# Altium schematic sheet usb_ethernet.SchDoc: DevelBoard EVA01 USB Host and Ethernet Connectors.
size A3; Author: Daniele Basile <asterix@develer.com>; Organization: Develer s.r.l.; Address1: via Mugellese 1/A; Address2: 50019 Campi Bisenzio; Address3: Firenze; Address4: ITALY; DocumentNumber: 5; Revision: B; SheetNumber: 5; SheetTotal: 6; Hw_rev: R2
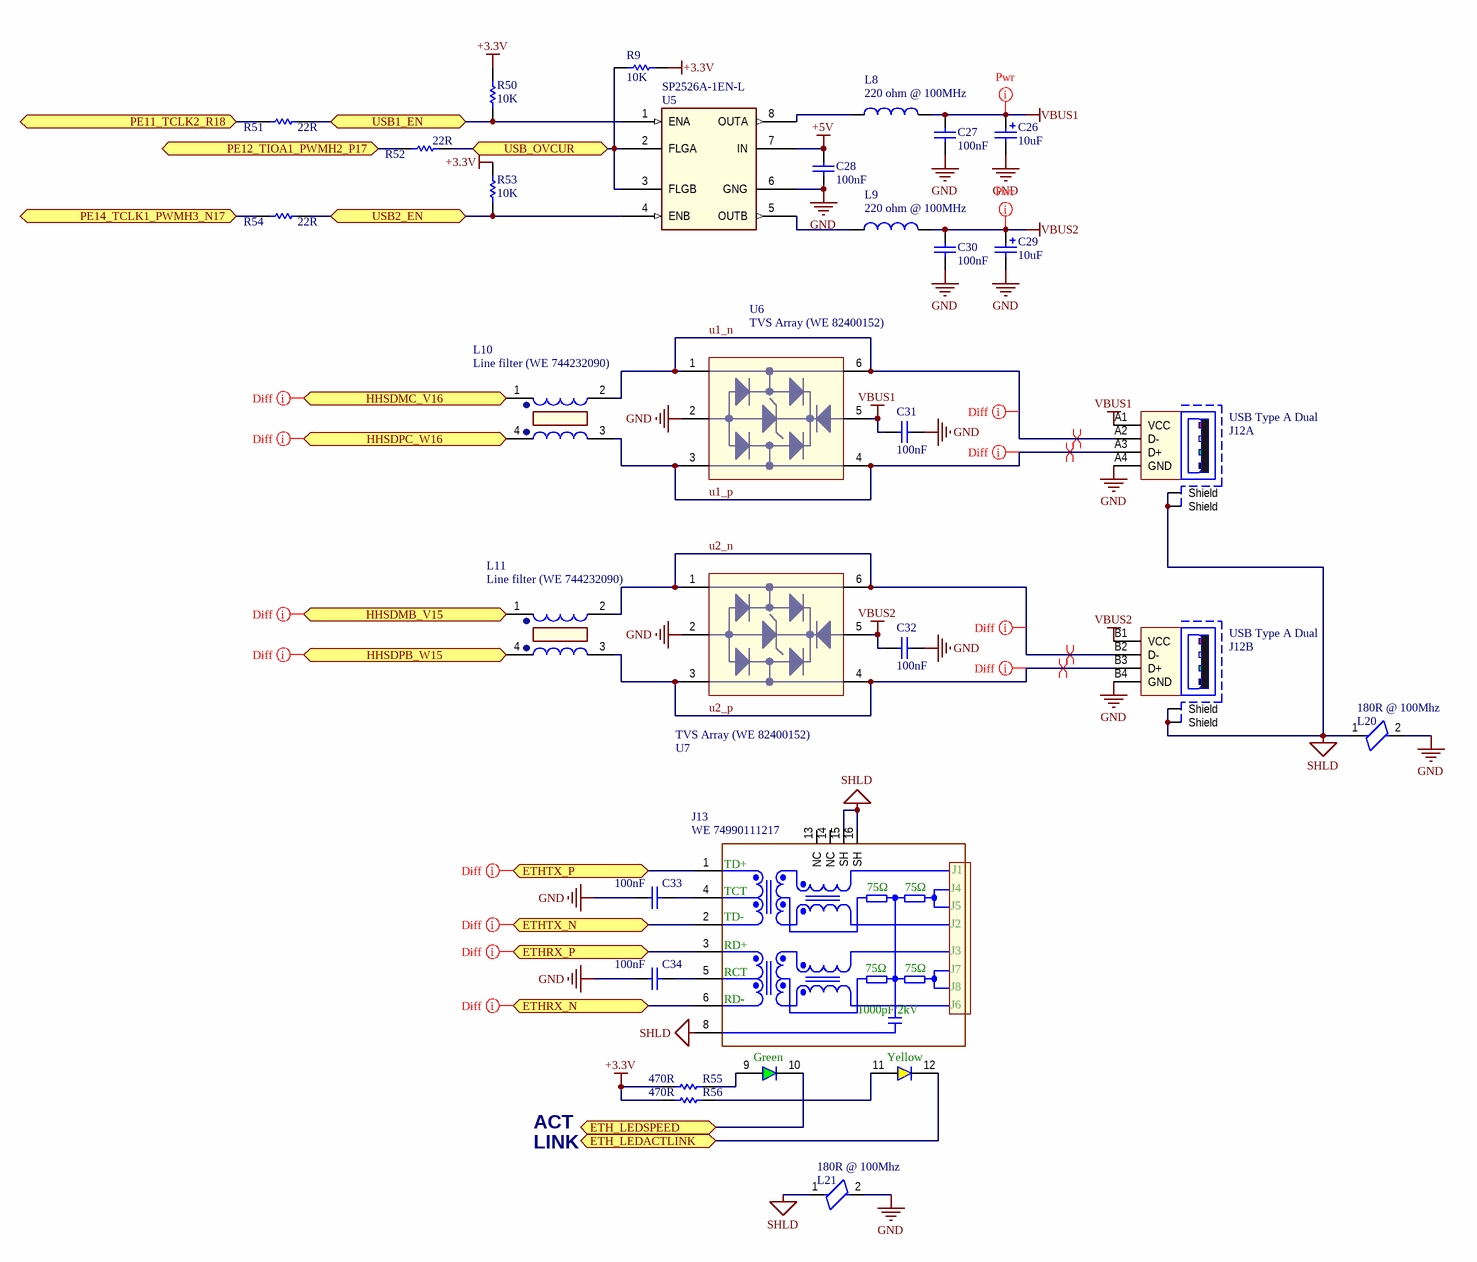
[diagram p0: usb_ethernet.SchDoc]

## Parts
C26  10uF  [1206_[3216]]
C27  100nF  [0603_[1608]]
C28  100nF  [0603_[1608]]
C29  10uF  [1206_[3216]]
C30  100nF  [0603_[1608]]
C31  100nF  [0603_[1608]]
C32  100nF  [0603_[1608]]
C33  100nF  [0603_[1608]]
C34  100nF  [0603_[1608]]
J12  USB Type A Dual  [USB_TypeA_Double_THD]  (parts A,B of 2)
J13  WE 74990111217  [RJ45_lan_transformer_horizontal]
L8  220 ohm @ 100MHz  [0805_[2012]]
L9  220 ohm @ 100MHz  [0805_[2012]]
L10  Line filter (WE 744232090)  [WE-CNSW_1206]
L11  Line filter (WE 744232090)  [WE-CNSW_1206]
L20  180R @ 100Mhz  [0603_[1608]]
L21  180R @ 100Mhz  [0603_[1608]]
R9  10K  [0603_[1608]]
R50  10K  [0603_[1608]]
R51  22R  [0603_[1608]]
R52  22R  [0603_[1608]]
R53  10K  [0603_[1608]]
R54  22R  [0603_[1608]]
R55  470R  [0603_[1608]]
R56  470R  [0603_[1608]]
U5  SP2526A-1EN-L  [SOIC8]
U6  TVS Array (WE 82400152)  [SOT-563]
U7  TVS Array (WE 82400152)  [SOT-563]

## Ports
ETH_LEDACTLINK, ETH_LEDSPEED, ETHRX_N, ETHRX_P, ETHTX_N, ETHTX_P, HHSDMB_V15, HHSDMC_V16, HHSDPB_W15, HHSDPC_W16, PE11_TCLK2_R18, PE12_TIOA1_PWMH2_P17, PE14_TCLK1_PWMH3_N17, USB1_EN, USB2_EN, USB_OVCUR

## Nets
+3.3V: R9.1 R50.1 R53.1 R55.2 R56.2
+5V: C28.1 U5.7(IN)
GND: C26.2 C27.2 C28.2 C29.2 C30.2 C31.1 C32.1 C33.2 C34.2 J12.A4(GND) J12.B4(GND) L20.2 L21.2 U5.6(GNG) U6.2 U7.2
SHLD: J12.Z1(Shield) J12.Z2(Shield) J12.Z3(Shield) J12.Z4(Shield) J13.8(SHLD) J13.15(SH) J13.16(SH) L20.1 L21.1
VBUS1: C26.1 C27.1 C31.2 J12.A1(VCC) L8.1 U6.5
VBUS2: C29.1 C30.1 C32.2 J12.B1(VCC) L9.1 U7.5
ETH_LEDACTLINK: J13.12(Kg) ; port ETH_LEDACTLINK
ETH_LEDSPEED: J13.10(Ky) ; port ETH_LEDSPEED
ETHRX_N: J13.6(RD-) ; port ETHRX_N
ETHRX_P: J13.3(RD+) ; port ETHRX_P
ETHTX_N: J13.2(TD-) ; port ETHTX_N
ETHTX_P: J13.1(TD+) ; port ETHTX_P
HHSDMB_V15: L11.1 ; port HHSDMB_V15
HHSDMC_V16: L10.1 ; port HHSDMC_V16
HHSDPB_W15: L11.4 ; port HHSDPB_W15
HHSDPC_W16: L10.4 ; port HHSDPC_W16
PE11_TCLK2_R18: R51.1 ; port PE11_TCLK2_R18
PE12_TIOA1_PWMH2_P17: R52.1 ; port PE12_TIOA1_PWMH2_P17
PE14_TCLK1_PWMH3_N17: R54.1 ; port PE14_TCLK1_PWMH3_N17
u1_n: J12.A2(D-) L10.2 U6.1 U6.6
u1_p: J12.A3(D+) L10.3 U6.3 U6.4
u2_n: J12.B2(D-) L11.2 U7.1 U7.6
u2_p: J12.B3(D+) L11.3 U7.3 U7.4
USB1_EN: R50.2 R51.2 U5.1(ENA) ; port USB1_EN
USB2_EN: R53.2 R54.2 U5.4(ENB) ; port USB2_EN
USB_OVCUR: R9.2 R52.2 U5.2(FLGA) U5.3(FLGB) ; port USB_OVCUR
NetC33_1: C33.1 J13.4(TCT)
NetC34_1: C34.1 J13.5(RCT)
NetJ13_9: J13.9(Ay) R55.1
NetJ13_11: J13.11(Ag) R56.1
NetL8_2: L8.2 U5.8(OUTA)
NetL9_2: L9.2 U5.5(OUTB)

Not connected (* = marked no-connect by the designer): J13 13(NC) 14(NC)

## Layout directives
net class Power: VBUS1, VBUS2
differential pair: u1_n, u1_p, u2_n, u2_p
net class usb1_diff: HHSDMC_V16, HHSDPC_W16, u1_n, u1_p
net class usb2_diff: HHSDMB_V15, HHSDPB_W15, u2_n, u2_p
net class eth_diff: ETHRX_N, ETHRX_P, ETHTX_N, ETHTX_P

## Notes on the sheet
- ACT
- LINK
- Title:
- Author:
- License:
- BSD
- Hw Rev:
- Rev:
- Size:
- A3
- File:
- Date:
- Time:
- Sheet
- of
- (in symbol RJ45LAN-10/100BaseT) J1; 75Ω; J4; J5; J2; J3; J7; J8; J6; 1000pF/2kV; Green; Yellow

## Library data of the parts
C26 C29 = Cap Pol1: Ceramic X5R 25V; Published: 8-Jun-2000; Revision: July-2002: Re-released for DXP Platform.; Publisher: Altium Limited; Value: 10uF
C27 C28 C30-C32 = Cap: Ceramic X7R 50V; Value: 100pF; Published: 8-Jun-2000; LatestRevisionDate: 17-Jul-2002; LatestRevisionNote: Re-released for DXP Platform.; PackageReference: RAD-0.3; Publisher: Altium Limited; PackageDescription: Radial Cap, Thru-Hole; 2 Leads; 0.3 in Pin Spacing
C33 C34 = Cap: Ceramic X7R 50V; Value: 10nF; Published: 8-Jun-2000; Revision: July-2002: Re-released for DXP Platform.; Publisher: Altium Limited
J12 = WE-Communication Connectors 61400826021: USB Type-A Double Connector (WE  61400826021); Manufacturer: Würth Elektronik eiSos GmbH; ComponentLink1 Description: Manufacturer; ComponentLink2 Description: Datasheet; NoPins: 8; ComponentLink1URL: http://www.we-online.de; ComponentLink2URL: http://katalog.we-online.de/em/datasheet/61400826021.pdf; Created by: Karrer Zheng; Created Date: 10/10/2014; partNo: 61400826021
J13 = RJ45LAN-10/100BaseT: Integrated RJ45 Transformer WE-RJ45LAN (WE 74990111217); PartNo: 74980111211; Manufacturer: Wurth Elektronik; E-mail: libraries@we-online.com; ComponentLink1Description: Manufacturer; ComponentLink1URL: http://www.we-online.de; Created by: Karrer Zheng; Created Date: Feb 2015; ComponentLink2Description: Datasheet; ComponentLink2URL: http://www.we-online.de/katalog/media/pdf/74980111211.pdf
L8 L9 = Inductor: Ferrite Beat (WE 742792022)
L10 L11 = Common_mode_choke: Common mode line filter
L20 L21 = BEAD_ FERRITE: Ferrite Beat (WE 7427927218)
R9 R50-R56 = Res1: Resistor; Value: 1K; Published: 8-Jun-2000; Revision: July-2002: Re-released for DXP Platform.; Publisher: Altium Limited
U5 = SP2526A-1EN-L: USB Power Supply swtich HI-SIDE dual.
U6 U7 = TVS_Diode_Array